# Altium schematic sheet 3D-Printer.SchDoc
size Letter; SheetNumber: 1; SheetTotal: 1
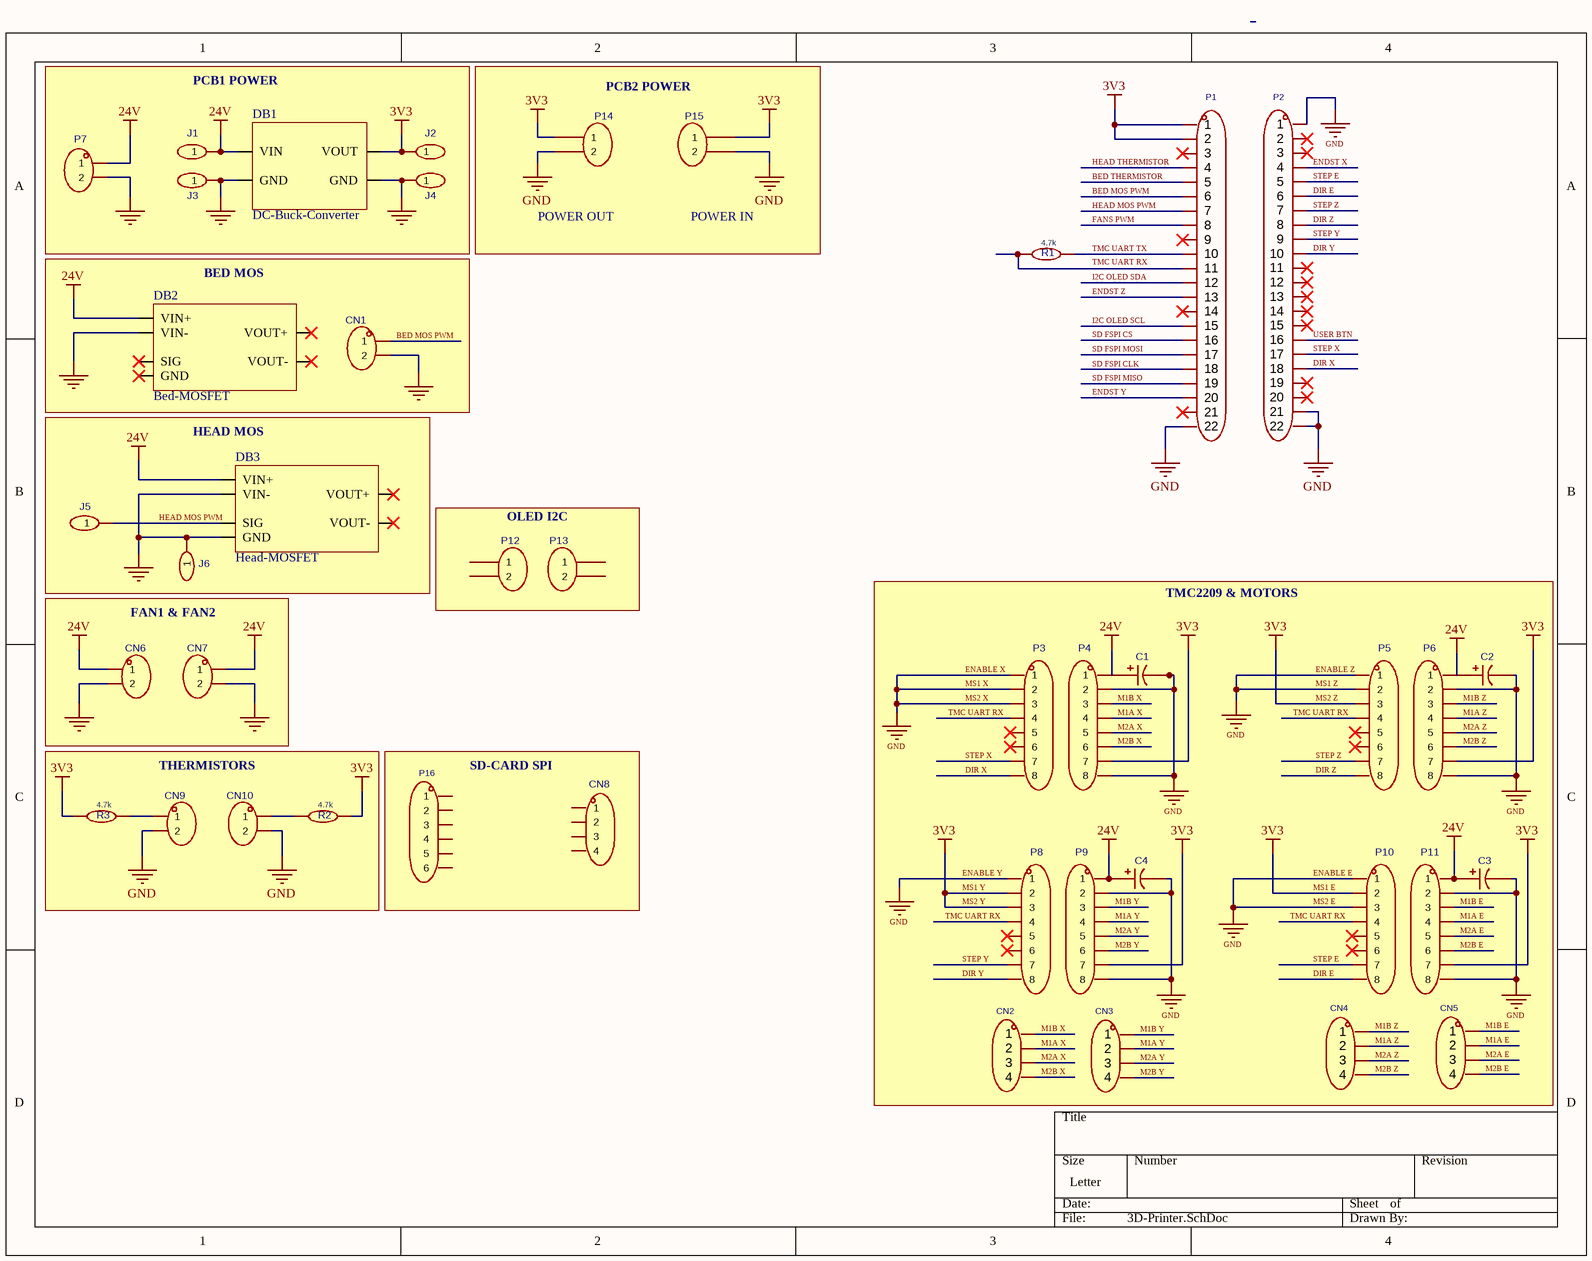
[diagram p0: 3D-Printer.SchDoc]

## Parts
C1  rvt1h101m0810 100uf 50v  [Capacitor-100uF]  (value not drawn)
C2  rvt1h101m0810 100uf 50v  [Capacitor-100uF]  (value not drawn)
C3  rvt1h101m0810 100uf 50v  [Capacitor-100uF]  (value not drawn)
C4  rvt1h101m0810 100uf 50v  [Capacitor-100uF]  (value not drawn)
CN1  sh-xh2.54-2p  [XH-2P]  (value not drawn)
CN2  sh-xh2.54-4p  [XH-4P]  (value not drawn)
CN3  sh-xh2.54-4p  [XH-4P]  (value not drawn)
CN4  sh-xh2.54-4p  [XH-4P]  (value not drawn)
CN5  sh-xh2.54-4p  [XH-4P]  (value not drawn)
CN6  sh-xh2.54-2p  [XH-2P]  (value not drawn)
CN7  sh-xh2.54-2p  [XH-2P]  (value not drawn)
CN8  wj127-5.0-04p-14-00a  [Screw-Terminal-4P]  (value not drawn)
CN9  sh-xh2.54-2p  [XH-2P]  (value not drawn)
CN10  sh-xh2.54-2p  [XH-2P]  (value not drawn)
DB1  DC-Buck-Converter  [DC-Buck-Converter]
DB2  Bed-MOSFET  [Bed-MOSFET]
DB3  Head-MOSFET  [Head-MOSFET]
J1  2.54-1*1p针  [Male-Header-1P]  (value not drawn)
J2  2.54-1*1p针  [Male-Header-1P]  (value not drawn)
J3  2.54-1*1p针  [Male-Header-1P]  (value not drawn)
J4  2.54-1*1p针  [Male-Header-1P]  (value not drawn)
J5  2.54-1*1p针  [Male-Header-1P]  (value not drawn)
J6  2.54-1*1p针  [Male-Header-1P]  (value not drawn)
P1  fh2.54-09-22pzd  [Female-Header-22P]  (value not drawn)
P2  fh2.54-09-22pzd  [Female-Header-22P]  (value not drawn)
P3  2.54-1*8p母环保  [Female-Header-8P]  (value not drawn)
P4  2.54-1*8p母环保  [Female-Header-8P]  (value not drawn)
P5  2.54-1*8p母环保  [Female-Header-8P]  (value not drawn)
P6  2.54-1*8p母环保  [Female-Header-8P]  (value not drawn)
P7  dbt30s-7.62-2p-bk-p  [Barrier-Terminal-2P]  (value not drawn)
P8  2.54-1*8p母环保  [Female-Header-8P]  (value not drawn)
P9  2.54-1*8p母环保  [Female-Header-8P]  (value not drawn)
P10  2.54-1*8p母环保  [Female-Header-8P]  (value not drawn)
P11  2.54-1*8p母环保  [Female-Header-8P]  (value not drawn)
P12  wj127-5.0-02p-14-00a  [Screw-Terminal-2P]  (value not drawn)
P13  wj127-5.0-02p-14-00a  [Screw-Terminal-2P]  (value not drawn)
P14  wj127-5.0-02p-14-00a  [Screw-Terminal-2P]  (value not drawn)
P15  wj127-5.0-02p-14-00a  [Screw-Terminal-2P]  (value not drawn)
P16  2.54-1*6p  [Female-Header-6P]  (value not drawn)
R1  4.7k  [Resistor-4.7k-0805]
R2  4.7k  [Resistor-4.7k-0805]
R3  4.7k  [Resistor-4.7k-0805]

## Blocks framed on the sheet
PCB1 POWER: DB1 J1-J4 P7
BED MOS: CN1 DB2
HEAD MOS: DB3 J5 J6
OLED I2C: P12 P13
TMC2209 & MOTORS: C1-C4 CN2-CN5 P3-P6 P8-P11
FAN1 & FAN2: CN6 CN7
THERMISTORS: CN9 CN10 R2 R3
SD-CARD SPI: CN8 P16

## Nets
24V: C1.1 C2.1 C3.1 C4.1 CN6.1 CN7.1 DB1.?1(VIN) DB2.?6(VIN+) DB3.?4(VIN+) J1.1 P4.1 P6.1 P7.1 P9.1 P11.1
ENABLE E: C1.2 C2.2 C3.2 C4.2 CN1.2 CN6.2 CN7.2 CN9.2 CN10.2 DB1.?2(GND) DB1.?4(GND) DB2.?3(VIN-) DB3.?3(VIN-) DB3.?6(GND) J3.1 J4.1 J6.1 P1.22 P2.1 P2.21 P2.22 P3.1 P3.2 P3.3 P4.2 P4.8 P5.1 P5.2 P6.2 P6.8 P7.2 P8.1 P9.2 P9.8 P10.1 P10.3 P11.2 P11.8 P14.2 P15.2  [also labelled ENABLE X, ENABLE Y, ENABLE Z, GND, MS1 X, MS1 Z, MS2 E, MS2 X]
MS1 E: DB1.?3(VOUT) J2.1 P1.1 P1.2 P4.7 P5.3 P6.7 P8.2 P8.3 P9.7 P10.2 P11.7 P14.1 P15.1 R2.1 R3.2  [also labelled 3V3, MS1 Y, MS2 Y, MS2 Z]
BED MOS PWM: CN1.1 P1.6
BED THERMISTOR: P1.5
DIR E: P2.6 P10.8
DIR X: P2.18 P3.8
DIR Y: P2.10 P8.8
DIR Z: P2.8 P5.8
ENDST X: P2.4
ENDST Y: P1.20
ENDST Z: P1.13
FANS PWM: P1.8
HEAD MOS PWM: DB3.?5(SIG) J5.1 P1.7
HEAD THERMISTOR: P1.4
I2C OLED SCL: P1.15
I2C OLED SDA: P1.12
M1A E: CN5.2 P11.4
M1A X: CN2.2 P4.4
M1A Y: CN3.2 P9.4
M1A Z: CN4.2 P6.4
M1B E: CN5.1 P11.3
M1B X: CN2.1 P4.3
M1B Y: CN3.1 P9.3
M1B Z: CN4.1 P6.3
M2A E: CN5.3 P11.5
M2A X: CN2.3 P4.5
M2A Y: CN3.3 P9.5
M2A Z: CN4.3 P6.5
M2B E: CN5.4 P11.6
M2B X: CN2.4 P4.6
M2B Y: CN3.4 P9.6
M2B Z: CN4.4 P6.6
SD FSPI CLK: P1.18
SD FSPI CS: P1.16
SD FSPI MISO: P1.19
SD FSPI MOSI: P1.17
STEP E: P2.5 P10.7
STEP X: P2.17 P3.7
STEP Y: P2.9 P8.7
STEP Z: P2.7 P5.7
TMC UART RX: P3.4 P5.4 P8.4 P10.4
TMC UART TX: P1.10 R1.1
USER BTN: P2.16
NetCN9_1: CN9.1 R3.1
NetCN10_1: CN10.1 R2.2
NetP1_11: P1.11 R1.2

Not connected (* = marked no-connect by the designer): CN8 1 2 3 4; DB2 ?1(VOUT-)* ?2(VOUT+)* ?4(GND)* ?5(SIG)*; DB3 ?1(VOUT+)* ?2(VOUT-)*; P1 3* 9* 14* 21*; P2 2* 3* 11* 12* 13* 14* 15* 19* 20*; P3 5* 6*; P5 5* 6*; P8 5* 6*; P10 5* 6*; P12 1 2; P13 1 2; P16 1 2 3 4 5 6

## Notes on the sheet
- PCB2 POWER
- POWER OUT
- POWER IN
- Labels drawn without touching a wire or pin: TMC UART RX

## Library data of the parts
C1-C4 = Capacitor-100uF: Capacitance:100uF Tolerance:±20% Tolerance:±20% Voltage Rating:50V Ripple Current:146mA@120Hz Equivalent Series Resistance(ESR):- Diameter:8mm Height - Seated (Max):10.2mm Lifetime:2800hrs@105℃ Operating Temperature:-55℃~+105℃ Operating Temperature:-55℃~+; Manufacturer: DMBJ(振宝佳); AddInBom: yes; ModelId: 9f9fc6857dc54a0ab164c419dde4584d; ModelName: CAP-SMD_BD8.0-L8.3-W8.3-LS9.1-FD; ModelTransform: 358.267,326.771,0,0,0,0,0,0,0; Tolerance: ±20%; Symbol: RVT1H101M0810 100UF 50V; LCSC Part Name: 100uF ±20% 50V; SupplierPart: C970687; ManufacturerPart: RVT1H101M0810 100UF 50V; Supplier Footprint: SMD,D8xL10.2mm; JLCPCB Part Class: Extended Part; Datasheet: https://item.szlcsc.com/datasheet/RVT1H101M0810%2520100UF%252050V/1060415.html; Supplier: LCSC; ConvertToPcb: yes; FootprintName: CAP-SMD_BD8.0-L8.3-W8.3-LS9.1-FD; Value: 100uF; Voltage Rating: 50V; Ripple Current: 146mA@120Hz; Equivalent Series Resistance(ESR): -; Diameter: 8mm; Height - Seated (Max): 10.2mm; Lifetime: 2800hrs@105℃; Operating Temperature: -55℃~+105℃
CN1 CN6 CN7 CN9 CN10 = XH-2P: Pins Structure:1x2P Pitch:2.5mm Mounting Type:Through Hole Number of Pins:2P Number of Rows:1 Number of PINs Per Row:2 Current Rating:3A Contact Material:Brass Contact Plating:Tin Operating Temperature:-25℃~+85℃ Operating Temperature:-25℃~+85℃ Voltage Rat; Manufacturer: 深海电子; AddInBom: yes; ModelId: 0fe0934827c24a35ba1321e64395c7dc; ModelName: CONN-TH_2P-P2.50-XH2.54-2P; ModelTransform: 295.275,228.346,0,180,0,0,-0.002,-20.079,-137.795; Pins Structure: 1x2P; Pitch: 2.5mm; Number of PINs Per Row: 2; Current Rating: 3A; Voltage Rating: 250V; Plastic Material: PA66; Flame Retardant Rating: UL94V-0; Z-Height of the Board: 7.1mm; X-Length of Bottom Edge on Board (Spacing Line): 7.5mm; Y-Width of Bottom Edge on Board: 5.8mm; Symbol: SH-XH2.54-2P; LCSC Part Name: 1x2P 间距:2.5mm 直插; SupplierPart: C53261323; ManufacturerPart: SH-XH2.54-2P; Supplier Footprint: 插件,P=2.5mm; JLCPCB Part Class: Extended Part; Datasheet: https://item.szlcsc.com/datasheet/SH-XH2.54-2P/56320007.html; Supplier: LCSC; ConvertToPcb: yes; FootprintName: CONN-TH_2P-P2.50-XH2.54-2P; Mounting Type: Through Hole; Number of Pins: 2P; Number of Rows: 1; Contact Material: Brass; Contact Plating: Tin; Operating Temperature: -25℃~+85℃; Color: White
CN2-CN5 = XH-4P: Pins Structure:1x4P Pitch:2.5mm Mounting Type:Through Hole Number of Pins:4P Number of Rows:1 Number of PINs Per Row:4 Current Rating:3A Contact Material:Brass Contact Plating:Tin Operating Temperature:-25℃~+85℃ Operating Temperature:-25℃~+85℃ Voltage Rat; Manufacturer: 深海电子; AddInBom: yes; ModelId: d6f2687bc06b47fb8e014feb06c7c5ec; ModelName: CONN-TH_4P-P2.50_4PIN; ModelTransform: 492.125,224.409,0,180,0,0,0,17.717,-118.11; Pins Structure: 1x4P; Pitch: 2.5mm; Number of PINs Per Row: 4; Current Rating: 3A; Voltage Rating: 250V; Plastic Material: PA66; Flame Retardant Rating: UL94V-0; Z-Height of the Board: 7.1mm; X-Length of Bottom Edge on Board (Spacing Line): 12.5mm; Y-Width of Bottom Edge on Board: 5.8mm; LCSC Part Name: 1x4P 间距:2.5mm 直插; SupplierPart: C53261325; ManufacturerPart: SH-XH2.54-4P; Supplier Footprint: 插件,P=2.5mm; JLCPCB Part Class: Extended Part; Datasheet: https://item.szlcsc.com/datasheet/SH-XH2.54-4P/56320009.html; Supplier: LCSC; ConvertToPcb: yes; SymbolName: SH-XH2.54-4P; FootprintName: CONN-TH_4P-P2.50_4PIN; Mounting Type: Through Hole; Number of Pins: 4P; Number of Rows: 1; Contact Material: Brass; Contact Plating: Tin; Operating Temperature: -25℃~+85℃; Color: White
CN8 = Screw-Terminal-4P: Number of Positions or Pins:1x4P Pitch:5mm Color:Green Mounting Type:Through Hole Number of Pins:4P Number of Rows:1 Number of PINs Per Row:4 Screw Specification:M2.5 Current Rating:15A Voltage Rating (Max):250V Wire Gauge - AWG:14~26 Wire Gauge - mm2:1.5; Manufacturer: KANGNEX(康奈克斯电气); Symbol: WJ127-5.0-4P; AddInBom: yes; ModelId: 30be887f740a4f6bacb9c64f3bb40a03; ModelName: CONN-TH_WJ5.00-LI-4P-127; ModelTransform: 807.0748,318.897,0,0,0,0,-9.843,7.874,-157.48; Number of Positions or Pins: 1x4P; Pitch: 5mm; Number of PINs Per Row: 4; Screw Specification: M2.5; Current Rating: 15A; Voltage Rating (Max): 250V; Wire Gauge - AWG: 14~26; Wire Gauge - mm2: 1.5; LCSC Part Name: 1x4P 5mm 直插 排数:1 每排P数:4; SupplierPart: C192779; ManufacturerPart: WJ127-5.0-04P-14-00A; Supplier Footprint: 插件,P=5mm; JLCPCB Part Class: Extended Part; Datasheet: https://item.szlcsc.com/datasheet/WJ127-5.0-04P-14-00A/225182.html; Supplier: LCSC; ConvertToPcb: yes; FootprintName: CONN-TH_4P-P5.00_WJ127-5.0-4P; Color: Green; Mounting Type: Through Hole; Number of Pins: 4P; Number of Rows: 1; Operating Temperature: -40℃~+105℃; Height Above Board: 10.14mm
J1-J6 = Male-Header-1P: Pin Structure:1x1P Pitch:- Row Spacing:- Circluar Pins/Square Pins:Pin Header Mounting Type:Through Hole Number of Rows:1 Number of Pins:1P Current Rating:3A Voltage Rating (Max):- Length of Mating Pin:6mm Insulation Height:2.5mm Length of End Connection; Manufacturer: BOOMELE(博穆精密); Symbol: Header-Male-2.54_1x1; AddInBom: yes; ModelId: 78ee2cec6acf483d85077eb0624e0da7; ModelName: HDR2.54-M-LI-1X1P; ModelTransform: 100,100,0,0,0,0,0,0,-118.11; Pin Structure: 1x1P; Current Rating: 3A; LCSC Part Name: 1x1P 方针 直插; SupplierPart: C81276; ManufacturerPart: 2.54-1*1P针; Supplier Footprint: 插件,P=2.54mm; JLCPCB Part Class: Extended Part; Datasheet: https://item.szlcsc.com/datasheet/2.54-1*1P%25E9%2592%2588/82426.html; Supplier: LCSC; ConvertToPcb: yes; FootprintName: HDR-TH_1P-P2.54-V-M; Pitch: -; Row Spacing: -; Circluar Pins/Square Pins: Pin Header; Mounting Type: Through Hole; Number of Rows: 1; Number of Pins: 1P; Voltage Rating (Max): -; Length of Mating Pin: 6mm; Insulation Height: 2.5mm; Length of End Connection Pin: 3mm; Contact Material: Brass; Contact Plating: Gold; Operating Temperature: -55℃~+105℃; Color: Black
P1 P2 = Female-Header-22P: Holes Structure:1x22P Pitch:2.54mm Circular Hole / Square Hole:Square Hole Mounting Type:Through Hole Number of Rows:1 Number of Positions:22P Current Rating:3A Holes Direction:Top Insulation Height:8.5mm Contact Material:Brass Contact Plating:Gold Operat; Manufacturer: XUNPU(讯普); AddInBom: yes; ModelId: 676cdefe1703484f8a37377e34cf1f64; ModelName: HDR-TH_22P-P2.54-V-F; ModelTransform: 2199.99552,98.425,0,0,0,0,0,0,-125.984; Holes Structure: 1x22P; Pitch: 2.54mm; Number of Positions: 22P; Current Rating: 3A; Holes Direction: Top; PIN Length: 3.2mm; LCSC Part Name: 1x22P 间距:2.54mm 直插; SupplierPart: C7500786; ManufacturerPart: FH2.54-09-22PZD; Supplier Footprint: 插件,P=2.54mm; JLCPCB Part Class: Extended Part; Datasheet: https://item.szlcsc.com/datasheet/FH2.54-09-22PZD/8579590.html; Supplier: LCSC; ConvertToPcb: yes; SymbolName: FH2.54-09-22PZD; FootprintName: HDR-TH_22P-P2.54-V-F; Circular Hole / Square Hole: Square Hole; Mounting Type: Through Hole; Number of Rows: 1; Insulation Height: 8.5mm; Contact Material: Brass; Contact Plating: Gold; Operating Temperature: -40℃~+105℃
P3-P6 P8-P11 = Female-Header-8P: Holes Structure:1x8P Pitch:2.54mm Row Spacing:- Circular Hole / Square Hole:Square Hole Mounting Type:Through Hole Number of Rows:1 Number of Positions:8P Current Rating:3A Holes Direction:Top Insulation Height:8.5mm Contact Material:Brass Contact Plating; Manufacturer: BOOMELE(博穆精密); Symbol: Header-Female-2.54_1x8; AddInBom: yes; ModelId: 6ab1dac21d924c3d8eea0dfa46d42ff5; ModelName: HDR-TH_8P-P2.54-V-F; ModelTransform: 819.723,98.425,0,0,0,0,0,0,-118.11; Holes Structure: 1x8P; Pitch: 2.54mm; Number of Positions: 8P; Current Rating: 3A; Holes Direction: Top; PIN Length: 3.2mm; LCSC Part Name: 1x8P 间距:2.54mm 直插; SupplierPart: C27438; ManufacturerPart: 2.54-1*8P母环保; Supplier Footprint: 插件,P=2.54mm; JLCPCB Part Class: Extended Part; Datasheet: https://item.szlcsc.com/datasheet/2.54-1*8P%25E6%25AF%258D%25E7%258E%25AF%25E4%25BF%259D/28187.html; Supplier: LCSC; ConvertToPcb: yes; FootprintName: HDR-TH_8P-P2.54-V-F; Row Spacing: -; Circular Hole / Square Hole: Square Hole; Mounting Type: Through Hole; Number of Rows: 1; Insulation Height: 8.5mm; Contact Material: Brass; Contact Plating: Gold; Operating Temperature: -55℃~+105℃
P7 = Barrier-Terminal-2P: Barrier Type:2-Side Pitch:7.62mm Number of Positions or Pins:1x2P Mounting Type:Straight Pin Location:Side Mount Number of Pins:2P Number of Rows:1 Number of PINs Per Row:2 Current Rating:15A Voltage Rating (Max):300V Wire Gauge - AWG:14~22 Wire Gauge - m; Manufacturer: DORABO(地博电气); AddInBom: yes; ModelId: 25793e1725c44f5c9873d21a6b0bc5c1; ModelName: CONN-TH_DBT30S-7.62-2P; ModelTransform: 659.0538,531.495,0,0,0,0,0,-150.276,-169.291; Barrier Type: 2-Side; Pitch: 7.62mm; Number of Positions or Pins: 1x2P; Number of PINs Per Row: 2; Current Rating: 15A; Voltage Rating (Max): 300V; Wire Gauge - AWG: 14~22; Symbol: DBT30S-7.62-2P; LCSC Part Name: 7.62mm 1x2P 直插 边脚 排数:1 每排P数:2; SupplierPart: C918082; ManufacturerPart: DBT30S-7.62-2P-BK-P; Supplier Footprint: 插件,P=7.62mm; JLCPCB Part Class: Extended Part; Datasheet: https://item.szlcsc.com/datasheet/DBT30S-7.62-2P-BK-P/993661.html; Supplier: LCSC; ConvertToPcb: yes; FootprintName: CONN-TH_DBT30S-7.62-2P; Mounting Type: Straight; Pin Location: Side Mount; Number of Pins: 2P; Number of Rows: 1; Wire Gauge - mm2: -; Operating Temperature: -40℃~+105℃; Color: Black
P12-P15 = Screw-Terminal-2P: Number of Positions or Pins:1x2P Pitch:5mm Color:Green Mounting Type:Through Hole Number of Pins:2P Number of Rows:1 Number of PINs Per Row:2 Screw Specification:M2.5 Current Rating:15A Voltage Rating (Max):250V Wire Gauge - AWG:14~26 Wire Gauge - mm2:1.5; Manufacturer: KANGNEX(康奈克斯电气); Symbol: WJ127-5.0-2P; AddInBom: yes; ModelId: 0c699dafc1fb4759bdee4490ad46ecba; ModelName: CONN-TH_2P-P5.00_CPC3703CTR; ModelTransform: 416.145,318.897,0,0,0,0,-11.811,5.315,-149.606; Number of Positions or Pins: 1x2P; Pitch: 5mm; Number of PINs Per Row: 2; Screw Specification: M2.5; Current Rating: 15A; Voltage Rating (Max): 250V; Wire Gauge - AWG: 14~26; Wire Gauge - mm2: 1.5; LCSC Part Name: 1x2P 5mm 直插 排数:1 每排P数:2; SupplierPart: C3703; ManufacturerPart: WJ127-5.0-02P-14-00A; Supplier Footprint: 插件,P=5mm; JLCPCB Part Class: Extended Part; Datasheet: https://item.szlcsc.com/datasheet/WJ127-5.0-02P-14-00A/4105.html; Supplier: LCSC; ConvertToPcb: yes; FootprintName: CONN-TH_2P-P5.00_CPC3703CTR; Color: Green; Mounting Type: Through Hole; Number of Pins: 2P; Number of Rows: 1; Operating Temperature: -40℃~+105℃; Height Above Board: 10.14mm
P16 = Female-Header-6P: Holes Structure:1x6P Pitch:2.54mm Row Spacing:- Circular Hole / Square Hole:Square Hole Mounting Type:Through Hole Number of Rows:1 Number of Positions:6P Current Rating:3A Voltage Rating (Max):- Holes Direction:Top Insulation Height:8.5mm Contact Materia; Manufacturer: BOOMELE(博穆精密); Manufacturer Part: 2.54-1*6P母; Symbol: Header-Female-2.54_1x6; AddInBom: yes; ModelId: 72da3eac8a074bb0a56a474e38d1760c; ModelName: HDR-TH_6P-P2.54-V-F; ModelTransform: 619.684,94.488,0,0,0,0,0,0,-125.984; Holes Structure: 1x6P; Pitch: 2.54mm; Number of Positions: 6P; Current Rating: 3A; Holes Direction: Top; PIN Length: 3.2mm; Supplier: LCSC; Supplier Part: C40877; JLCPCB Part Class: Extended Part; LCSC Part Name: 1x6P 间距:2.54mm 直插; Supplier Footprint: 插件,P=2.54mm; Datasheet: https://item.szlcsc.com/datasheet/2.54-1*6P%25E6%25AF%258D/41861.html; ConvertToPcb: yes; FootprintName: HDR-TH_6P-P2.54-V-F; Row Spacing: -; Circular Hole / Square Hole: Square Hole; Mounting Type: Through Hole; Number of Rows: 1; Voltage Rating (Max): -; Insulation Height: 8.5mm; Contact Material: Brass; Contact Plating: Gold; Operating Temperature: -40℃~+105℃; Supplementary Features: -
R1-R3 = Resistor-4.7k-0805: Type:Thick Film Resistors Resistance:4.7kΩ Tolerance:±1% Tolerance:±1% Power(Watts): Overload Voltage (Max): Temperature Coefficient:±100ppm/℃ Temperature Coefficient:±100ppm/℃ Operating Temperature Range:-55℃~+155℃ Operating Temperature Range:-55℃~+155℃; Manufacturer: UNI-ROYAL(厚声); Symbol: 0805W8F4701T5E; AddInBom: yes; ModelId: b83c7c5430874b8eb2319a65d9433429; ModelName: R0805_L2.0-W1.3-H0.6; ModelTransform: 78.74,51.181,0,0,0,0,0,-0.0005,0; Value: 4.7kΩ; Tolerance: ±1%; LCSC Part Name: 4.7kΩ ±1% 125mW 厚膜电阻; SupplierPart: C17673; ManufacturerPart: 0805W8F4701T5E; Supplier Footprint: 0805; JLCPCB Part Class: Basic Part; Datasheet: https://atta.szlcsc.com/upload/public/pdf/source/20200306/C422600_1E6D84923E4A46A82E41ADD87F860B5C.pdf; Supplier: LCSC; ConvertToPcb: yes; FootprintName: R0805; Type: Thick Film Resistors; Temperature Coefficient: ±100ppm/℃; Operating Temperature Range: -55℃~+155℃